# Altium schematic sheet SnifferRS232.SchDoc
size A2; Address1: Address1; Address2: Address2; Address3: Address3; Address4: Address4; SheetNumber: 1; Scale: 1:1; Разраб.: Яковлев; Наименование изделия 1: SnifferRS232; Наименование изделия 2: Схема электрическая; Наименование изделия 3: принципиальная
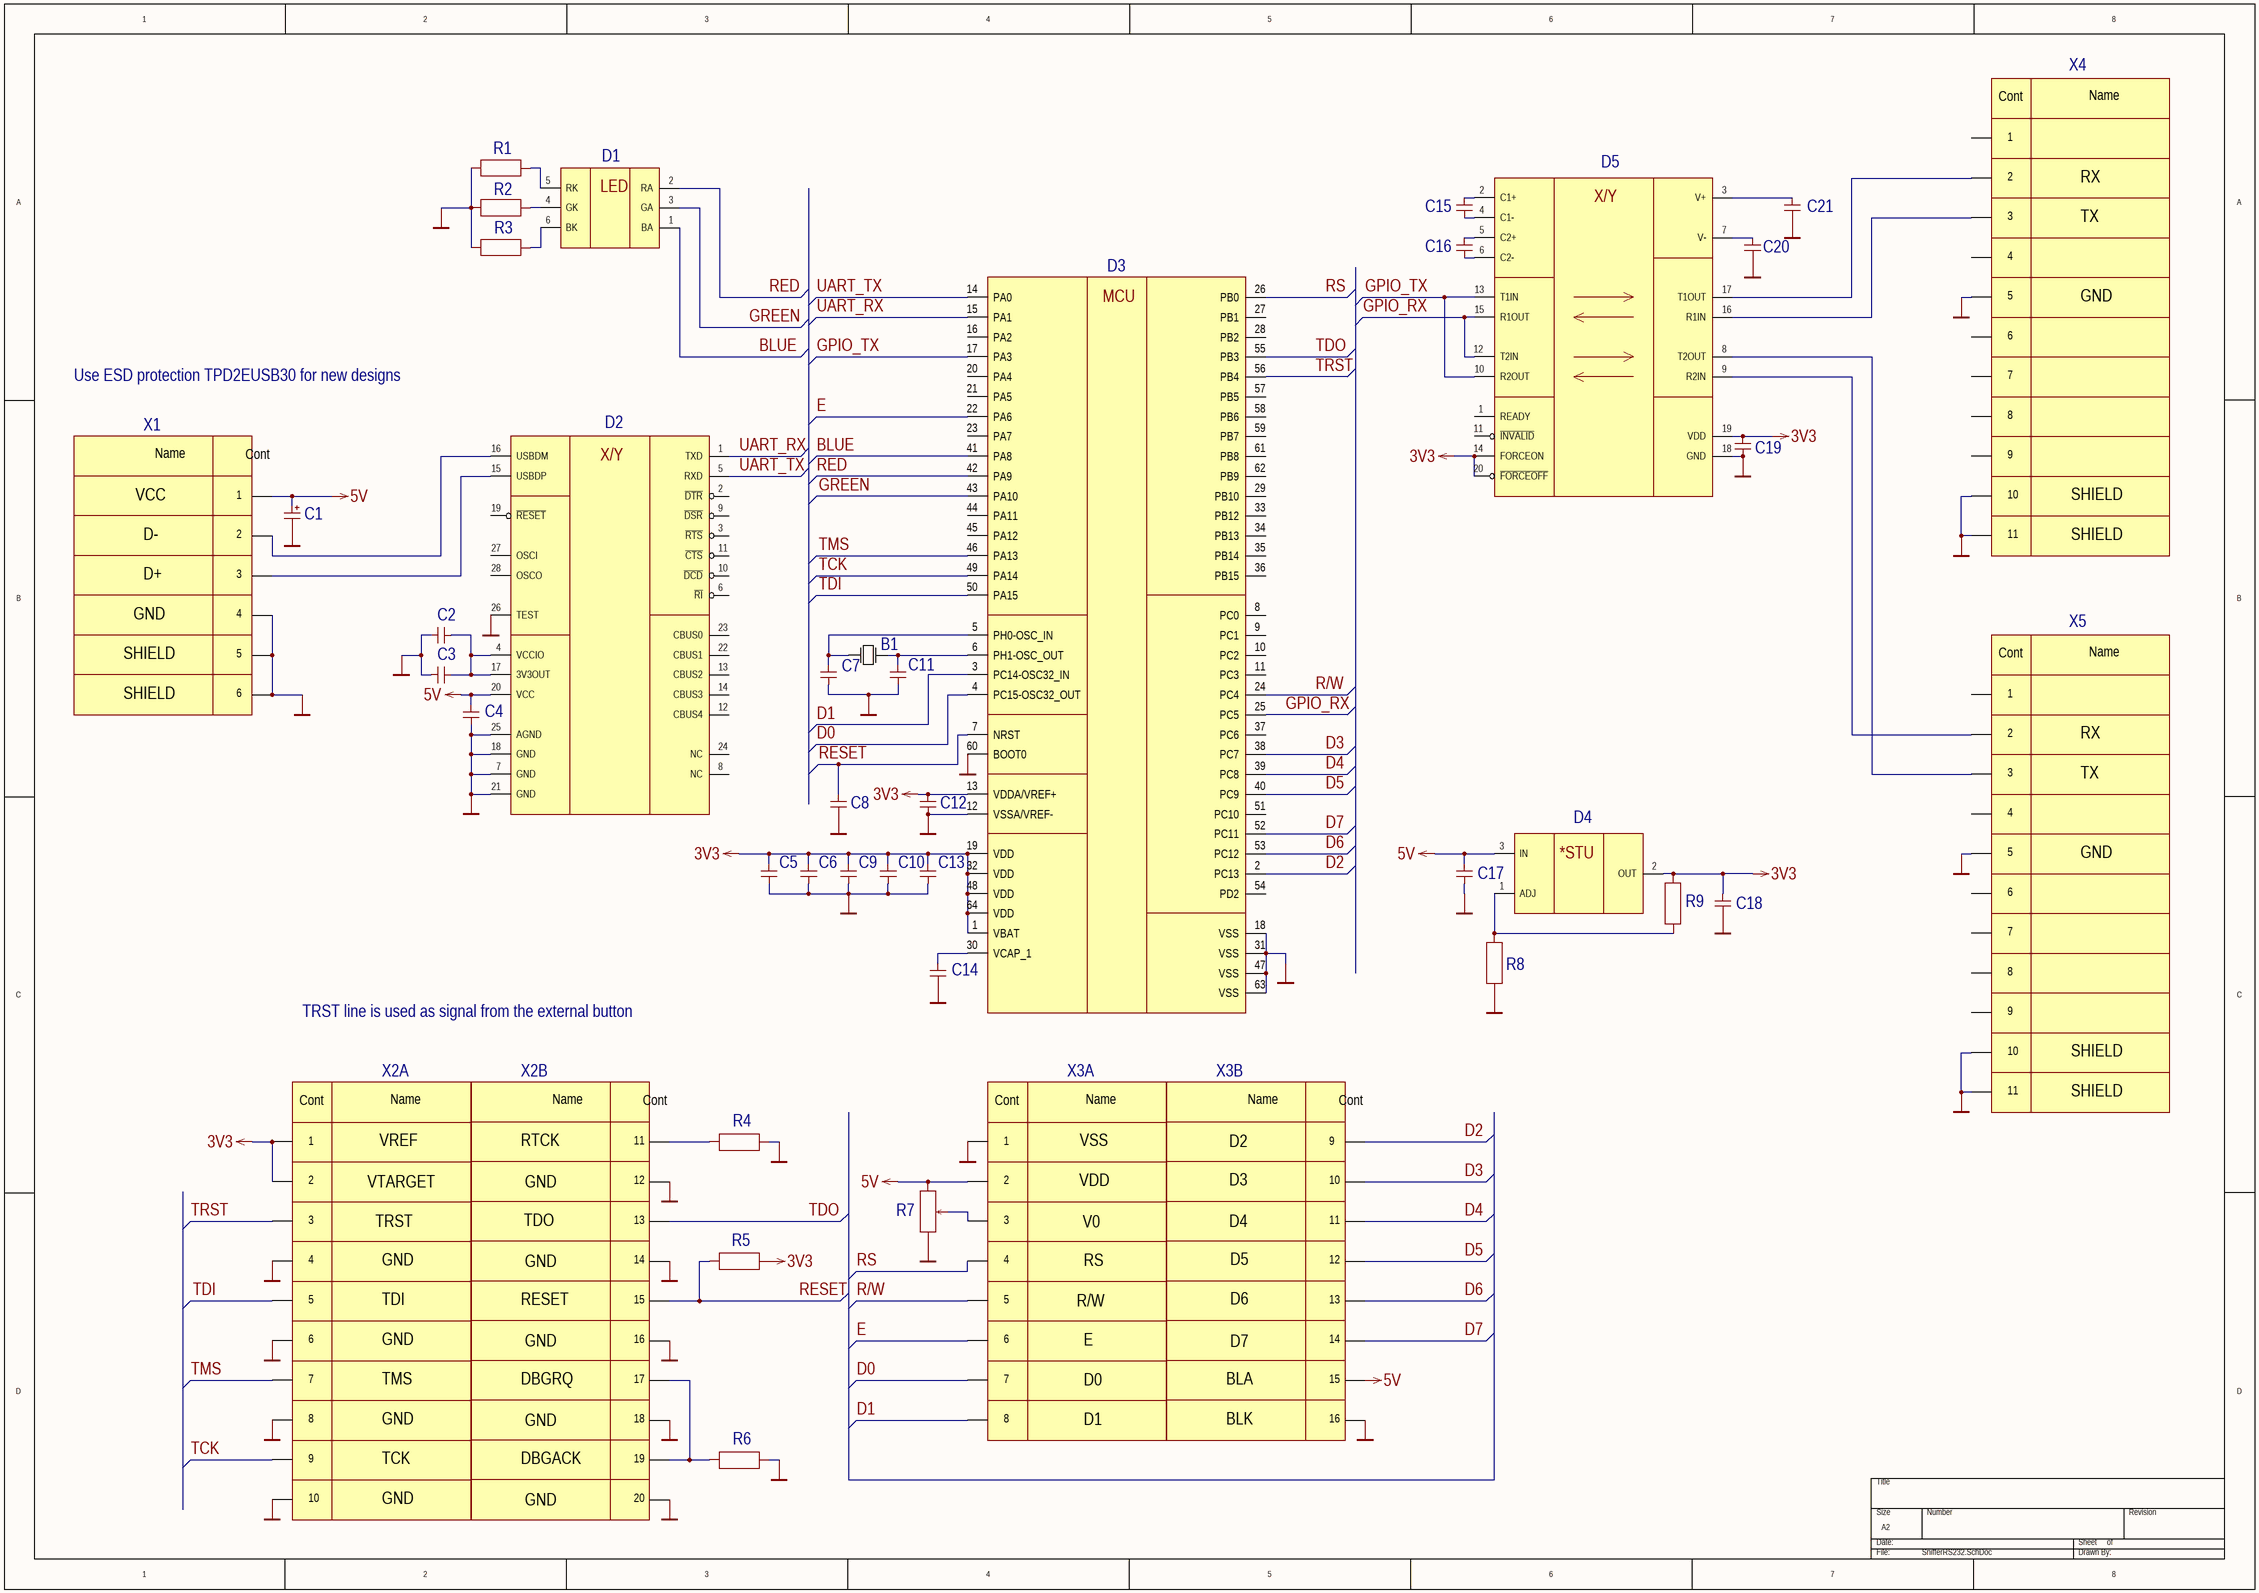
[diagram p0: SnifferRS232.SchDoc]

## Parts
B1  ZQ1 KX-3H 25.0 MHz  [KX-3H]  (value not drawn)
C1  1208-16 V-100uF  [CAP_5x11]  (value not drawn)
C2  0805-16 V-X7R-0.1uF±10 %  [SMD-0805C]  (value not drawn)
C3  0805-16 V-X7R-0.1uF±10 %  [SMD-0805C]  (value not drawn)
C4  0805-16 V-X7R-0.1uF±10 %  [SMD-0805C]  (value not drawn)
C5  0805-16 V-X7R-0.1uF±10 %  [SMD-0805C]  (value not drawn)
C6  0805-16 V-X7R-0.1uF±10 %  [SMD-0805C]  (value not drawn)
C7  0805-50 V-COG-22pF±5 %  [SMD-0805C]  (value not drawn)
C8  0805-16 V-X7R-0.1uF±10 %  [SMD-0805C]  (value not drawn)
C9  0805-16 V-X7R-0.1uF±10 %  [SMD-0805C]  (value not drawn)
C10  0805-16 V-X7R-0.1uF±10 %  [SMD-0805C]  (value not drawn)
C11  0805-50 V-COG-22pF±5 %  [SMD-0805C]  (value not drawn)
C12  0805-16 V-X7R-0.1uF±10 %  [SMD-0805C]  (value not drawn)
C13  0805-16 V-X7R-0.1uF±10 %  [SMD-0805C]  (value not drawn)
C14  0805-16 V-X7R-4.7uF±10 %  [SMD-0805C]  (value not drawn)
C15  0805-16 V-X7R-0.1uF±10 %  [SMD-0805C]  (value not drawn)
C16  0805-16 V-X7R-0.1uF±10 %  [SMD-0805C]  (value not drawn)
C17  0805-16 V-X7R-1uF±10 %  [SMD-0805C]  (value not drawn)
C18  0805-16 V-X7R-1uF±10 %  [SMD-0805C]  (value not drawn)
C19  0805-16 V-X7R-0.1uF±10 %  [SMD-0805C]  (value not drawn)
C20  0805-16 V-X7R-0.1uF±10 %  [SMD-0805C]  (value not drawn)
C21  0805-16 V-X7R-0.1uF±10 %  [SMD-0805C]  (value not drawn)
D1  TO-5050BC-MRPBFGF  [smd_50x50]  (value not drawn)
D2  FT232RL  [SSOP-28_M]  (value not drawn)
D3  STM32F446RCT6  [LQFP64]  (value not drawn)
D4  LM317DCYR  [SOT223_M]  (value not drawn)
D5  MAX3225ECAP+  [TSSOP-20]  (value not drawn)
R1  0805±5 %-680 Ohm  [SMD-0805-RES]  (value not drawn)
R2  0805±5 %-680 Ohm  [SMD-0805-RES]  (value not drawn)
R3  0805±5 %-0 Ohm  [SMD-0805-RES]  (value not drawn)
R4  0805±5 %-10 kOhm  [SMD-0805-RES]  (value not drawn)
R5  0805±5 %-10 kOhm  [SMD-0805-RES]  (value not drawn)
R6  0805±5 %-10 kOhm  [SMD-0805-RES]  (value not drawn)
R7  CA9PV10-10KA2020  [CA9V]  (value not drawn)
R8  0805±1 %-2 kOhm  [SMD-0805-RES]  (value not drawn)
R9  0805±1 %-1.3 kOhm  [SMD-0805-RES]  (value not drawn)
X1  DS1099-BN0  [FCI USB 61729-0010BLF]  (value not drawn)
X2  DS1021-2*10SF11-B  [PLD2x10]  (value not drawn)  (parts A,B of 2)
X3  DS1021-1*16SF112  [PLS-16_12]  (value not drawn)  (parts A,B of 2)
X4  DS1037-09FNAKT74-0CC  [DB-9F]  (value not drawn)
X5  DS1037-09MNAKT74-0CC  [DB-9M]  (value not drawn)

## Nets
3V3: C5.1 C6.1 C9.1 C10.1 C12.1 C13.1 C18.2 C19.1 D3.1(VBAT) D3.13(VDDA/VREF+) D3.19(VDD) D3.32(VDD) D3.48(VDD) D3.64(VDD) D4.2(OUT) D5.14(FORCEON) D5.19(VDD) D5.20(~{FORCEOFF}) R5.1 R9.2 X2.1 X2.2
5V: C1.1 C4.1 C17.2 D2.20(VCC) D4.3(IN) R7.3 X1.1 X3.2 X3.15
GND: C1.2 C2.1 C3.1 C4.2 C5.2 C6.2 C7.2 C8.2 C9.2 C10.2 C11.2 C12.2 C13.2 C14.2 C17.1 C18.1 C19.2 C20.2 C21.2 D2.7(GND) D2.18(GND) D2.21(GND) D2.25(AGND) D2.26(TEST) D3.12(VSSA/VREF-) D3.18(VSS) D3.31(VSS) D3.47(VSS) D3.60(BOOT0) D3.63(VSS) D5.18(GND) R1.2 R2.2 R3.2 R4.2 R6.2 R7.1 R8.2 X1.4 X1.5 X1.6 X2.4 X2.6 X2.8 X2.10 X2.12 X2.14 X2.16 X2.18 X2.20 X3.1 X3.16 X4.5 X4.10 X4.11 X5.5 X5.10 X5.11
BLUE: D1.1(BA) D3.41(PA8)
D0: D3.4(PC15-OSC32_OUT) X3.7
D1: D3.3(PC14-OSC32_IN) X3.8
D2: D3.2(PC13) X3.9
D3: D3.38(PC7) X3.10
D4: D3.39(PC8) X3.11
D5: D3.40(PC9) X3.12
D6: D3.53(PC12) X3.13
D7: D3.52(PC11) X3.14
E: D3.22(PA6) X3.6
GPIO_RX: D3.25(PC5) D5.12(T2IN) D5.15(R1OUT)
GPIO_TX: D3.17(PA3) D5.10(R2OUT) D5.13(T1IN)
GREEN: D1.3(GA) D3.43(PA10)
R/W: D3.24(PC4) X3.5
RED: D1.2(RA) D3.42(PA9)
RESET: C8.1 D3.7(NRST) R5.2 X2.15
RS: D3.26(PB0) X3.4
TCK: D3.49(PA14) X2.9
TDI: D3.50(PA15) X2.5
TDO: D3.55(PB3) X2.13
TMS: D3.46(PA13) X2.7
TRST: D3.56(PB4) X2.3
UART_RX: D2.1(TXD) D3.15(PA1)
UART_TX: D2.5(RXD) D3.14(PA0)
NetB1_1: B1.1(OSCIN) C11.1 D3.6(PH1-OSC_OUT)
NetB1_2: B1.2(OSCOUT) C7.1 D3.5(PH0-OSC_IN)
NetC2_2: C2.2 C3.2 D2.4(VCCIO) D2.17(3V3OUT)
NetC14_1: C14.1 D3.30(VCAP_1)
NetC15_1: C15.1 D5.2(C1+)
NetC15_2: C15.2 D5.4(C1-)
NetC16_1: C16.1 D5.5(C2+)
NetC16_2: C16.2 D5.6(C2-)
NetC20_1: C20.1 D5.7(V-)
NetC21_1: C21.1 D5.3(V+)
NetD1_4: D1.4(GK) R2.1
NetD1_5: D1.5(RK) R1.1
NetD1_6: D1.6(BK) R3.1
NetD2_15: D2.15(USBDP) X1.3
NetD2_16: D2.16(USBDM) X1.2
NetD4_1: D4.1(ADJ) R8.1 R9.1
NetD5_8: D5.8(T2OUT) X5.3
NetD5_9: D5.9(R2IN) X5.2
NetD5_16: D5.16(R1IN) X4.3
NetD5_17: D5.17(T1OUT) X4.2
NetR4_1: R4.1 X2.11
NetR6_1: R6.1 X2.17 X2.19
NetR7_2: R7.2 X3.3

Not connected (* = marked no-connect by the designer): D2 2(~{DTR}) 3(~{RTS}) 6(~{RI}) 8(NC) 9(~{DSR}) 10(~{DCD}) 11(~{CTS}) 12(CBUS4) 13(CBUS2) 14(CBUS3) 19(~{RESET}) 22(CBUS1) 23(CBUS0) 24(NC) 27(OSCI) 28(OSCO); D3 8(PC0) 9(PC1) 10(PC2) 11(PC3) 16(PA2) 20(PA4) 21(PA5) 23(PA7) 27(PB1) 28(PB2) 29(PB10) 33(PB12) 34(PB13) 35(PB14) 36(PB15) 37(PC6) 44(PA11) 45(PA12) 51(PC10) 54(PD2) 57(PB5) 58(PB6) 59(PB7) 61(PB8) 62(PB9); D5 1(READY) 11(~{INVALID}); X4 1 4 6 7 8 9; X5 1 4 6 7 8 9

## Notes on the sheet
- RX
- TX
- GND
- Use ESD protection TPD2EUSB30 for new designs
- VCC
- D-
- SHIELD
- D+
- TRST line is used as signal from the external button
- VREF
- RTCK
- VSS
- D2
- VTARGET
- VDD
- D3
- TRST
- TDO
- V0
- D4
- TDI
- RESET
- RS
- D5
- D6
- R/W
- E
- D7
- TMS
- DBGRQ
- D0
- BLA
- D1
- BLK
- TCK
- DBGACK
- Перв. примен.
- Справ. №
- Подп. и дата
- Инв. № дубл.
- Взам. инв. №
- Разраб.
- Изм.
- Лист
- № докум.
- Подп.
- Дата
- Лит.
- Масса
- Масштаб
- Пров.
- Т.контр.
- Листов
- Инв. № подл.
- Утв.
- Н.контр.
- Копировал
- Формат А2
- (in symbol DB-9) Cont; Name
- (in symbol FT232R) X/Y
- (in symbol LED_RGB) LED
- (in symbol LM317) *STU
- (in symbol MAX3225) X/Y
- (in symbol PLD2x8, part A) Cont; Name
- (in symbol PLD2x8, part B) Name; Cont
- (in symbol PLD2x10, part A) Cont; Name
- (in symbol PLD2x10, part B) Name; Cont
- (in symbol STM32F446RxT) MCU
- (in symbol USB-B) Name; Cont

## Library data of the parts
B1 = Oscillator: Crystal oscillator; Manufacturer: Geyer Electronic; ComponentLink1Description: Datasheet; ComponentLink1URL: http://www.geyer-electronic.de/uploads/tx_userartikelfrequenz/GEYER-KX-3H.pdf
C1 = Cap_el: Electrolytic capacitor; Value: 100 uF; Manufacturer: *; ComponentLink1Description: Datasheet; ComponentLink1URL: *
C2 C3 C5 C6 C8-C10 C12 C13 C15 C16 C19-C21 = Cap: Capacitor; Value: 0.1 uF; Manufacturer: *; ComponentLink1Description: Datasheet; ComponentLink1URL: *
C4 = Cap: Capacitor; Value: 0,1 мкФ; Manufacturer: *; ComponentLink1Description: Datasheet; ComponentLink1URL: *
C7 C11 = Cap: Capacitor; Value: 22 pF; Manufacturer: *; ComponentLink1Description: Datasheet; ComponentLink1URL: *
C14 = Cap: Capacitor; Value: 4.7 uF; Manufacturer: *; ComponentLink1Description: Datasheet; ComponentLink1URL: *
C17 C18 = Cap: Capacitor; Value: 1 uF; Manufacturer: *; ComponentLink1Description: Datasheet
D1 = LED_RGB: Surface mount smd LED; Manufacturer: Oasis Technology; ComponentLink1Description: Datasheet; ComponentLink1URL: https://static.chipdip.ru/lib/736/DOC002736076.pdf
D2 = FT232R: USB UART Asynchronous Serial Data Transfer Chip, SSOP-28, Tape and Reel; Manufacturer: FTDI; ComponentLink1Description: Datasheet; ComponentLink1URL: http://www.ftdichip.com/Support/Documents/DataSheets/ICs/DS_FT232R.pdf
D3 = STM32F446RxT: High-performance foundation line, ARM Cortex-M4 core with DSP and FPU, 256 Kbytes Flash, 180 MHz CPU, ART Accelerator, Dual QSPI; Manufacturer: STMicroelectronics; ComponentLink1Description: Datasheet; ComponentLink1URL: http://www.st.com/content/ccc/resource/technical/document/datasheet/65/cb/75/50/53/d6/48/24/DM00141306.pdf/files/DM00141306.pdf/jcr:content/translations/en.DM00141306.pdf
D4 = LM317: 3-Terminal Adjustable Regulator; Manufacturer: Texas Instruments; ComponentLink1Description: Datasheet; ComponentLink1URL: http://www.ti.com/lit/ds/symlink/lm317.pdf
D5 = MAX3225: ±15kV ESD-Protected, 1µA, 1Mbps, 3.0V to 5.5V,  RS-232 Transceivers with AutoShutdown Plus; Manufacturer: Maxim Integrated; ComponentLink1Description: Datasheet; ComponentLink1URL: https://datasheets.maximintegrated.com/en/ds/MAX3224E-MAX3245E.pdf
R1 R2 = Res: Resistor; Value: 680 Ohm; Manufacturer: *; ComponentLink1Description: Datasheet; ComponentLink1URL: *
R3 = Res: Resistor; Value: 0 Ohm; Manufacturer: *; ComponentLink1Description: Datasheet; ComponentLink1URL: *
R4-R6 = Res: Resistor; Value: 10 kOhm; Manufacturer: *; ComponentLink1Description: Datasheet; ComponentLink1URL: *
R7 = Potentiometer: Manufacturer: ACP Technologies; Value: 10 kOhm; ComponentLink1Description: Datasheet; ComponentLink1URL: https://lib.chipdip.ru/053/DOC000053676.pdf
R8 = Res: Resistor; Value: 2 kOhm; Manufacturer: *; ComponentLink1Description: Datasheet
R9 = Res: Resistor; Value: 1.3 kOhm; Manufacturer: *; ComponentLink1Description: Datasheet
X1 = USB-B: USB-B connector; Manufacturer: Connfly Electronic; ComponentLink1Description: Datasheet; ComponentLink1URL: http://www.connfly.com/userfiles/image/UpLoadFile/File/2016/1/20/DS1099.pdf
X2 = PLD2x10: PLD-20 connector; Manufacturer: Connfly Electronic; ComponentLink1Description: Datasheet; ComponentLink1URL: http://www.connfly.com/userfiles/image/UpLoadFile/File/2015/1/29/DS1021.pdf
X3 = PLD2x8: PLD-16 connector; Manufacturer: Connfly  Electronic; ComponentLink1Description: Datasheet; ComponentLink1URL: http://www.connfly.com/userfiles/image/UpLoadFile/File/2015/1/29/DS1021.pdf
X4 = DB-9: DB-9 female connector; Manufacturer: Connfly Electronic; ComponentLink1Description: Datasheet; ComponentLink1URL: http://www.connfly.com/userfiles/image/UpLoadFile/File/2013/12/14/DS1037.pdf
X5 = DB-9: DB-9 male connector; Manufacturer: Connfly Electronic; ComponentLink1Description: Datasheet; ComponentLink1URL: http://www.connfly.com/userfiles/image/UpLoadFile/File/2013/12/14/DS1037.pdf